# EAGLE design espyollucopy (EAGLE 9.6.2)
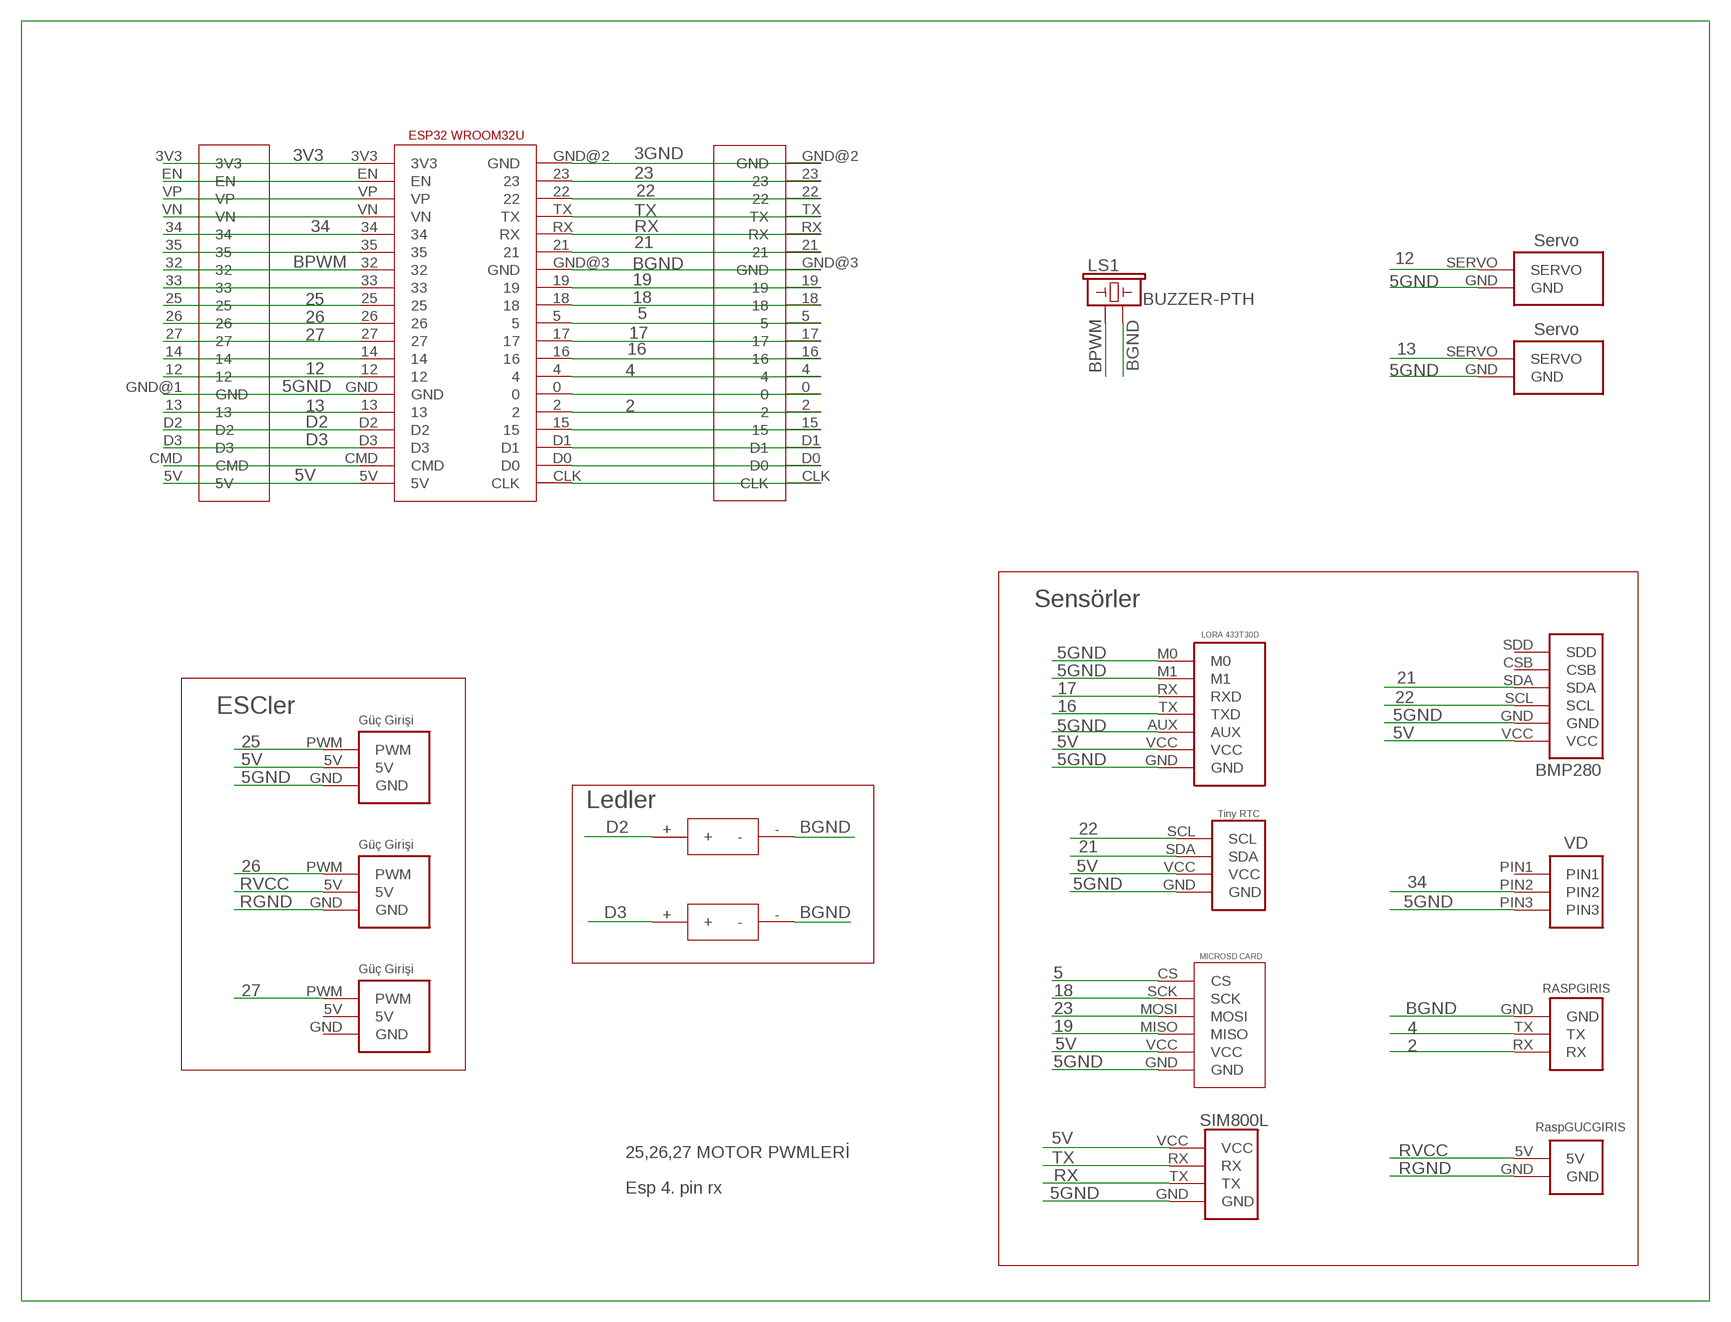
[diagram p0: schematic, sheet 1]

## Parts
BMP1  BMP280  [BMP280]
LS1  BUZZER-PTH  [BUZZER-12MM]
U$1  TINYRTC  [TINYRTC]
U$2  VOLTAGE_DIVIDER  [VOLTAGE_DIVIDER]
U$3  RASPGIRIS  [RASPGIRIS]
U$4  ESP32WROOM32U  [ESP32WROOM32U]
U$5  LORAFULLSIZE  [LORAFULLSIZE]
U$6  MICROSD_CARD  [MICROSD_CARD]
U$7  SERVO_SIGNAL  [SERVO_SIGNAL]
U$8  SIM800L  [SIM800L]
U$9  SERVO_SIGNAL  [SERVO_SIGNAL]
U$10  RASPGUCGIRIS  [RASPGUCGIRIS]
U$11  ESC_GIRIS  [ESC_GIRIS]
U$12  ESC_GIRIS  [ESC_GIRIS]
U$13  ESC_GIRIS  [ESC_GIRIS]
U$14  ESPSAGPIN  [ESPSAGPIN]
U$15  ESPSOLPIN  [ESPSOLPIN]
U$17  LED  [LED]
U$18  LED  [LED]

## Nets
2: U$3.RX U$4.2 U$14.2
3GND: U$4.GND@2(GND) U$14.GND@2(GND)
3V3: U$4.3V3 U$15.3V3
4: U$3.TX U$4.4 U$14.4
5: U$4.5 U$6.CS U$14.5
5GND: BMP1.GND U$1.GND U$2.PIN3 U$4.GND U$5.AUX U$5.GND U$5.M0 U$5.M1 U$6.GND U$7.GND U$8.GND U$9.GND U$11.GND U$15.GND@1(GND)
5V: BMP1.VCC U$1.VCC U$4.5V U$5.VCC U$6.VCC U$8.VCC U$11.5V U$15.5V
12: U$4.12 U$7.SERVO U$15.12
13: U$4.13 U$9.SERVO U$15.13
16: U$4.16 U$5.TX(TXD) U$14.16
17: U$4.17 U$5.RX(RXD) U$14.17
18: U$4.18 U$6.SCK U$14.18
19: U$4.19 U$6.MISO U$14.19
21: BMP1.SDA U$1.SDA U$4.21 U$14.21
22: BMP1.SCL U$1.SCL U$4.22 U$14.22
23: U$4.23 U$6.MOSI U$14.23
25: U$4.25 U$11.PWM U$15.25
26: U$4.26 U$12.PWM U$15.26
27: U$4.27 U$13.PWM U$15.27
34: U$2.PIN2 U$4.34 U$15.34
BGND: LS1.- U$3.GND U$4.GND@3(GND) U$14.GND@3(GND) U$17.- U$18.-
BPWM: LS1.+ U$4.32 U$15.32
D2: U$4.D2 U$15.D2 U$17.+
D3: U$4.D3 U$15.D3 U$18.+
N$3: U$4.EN U$15.EN
N$4: U$4.VP U$15.VP
N$5: U$4.VN U$15.VN
N$7: U$4.35 U$15.35
N$9: U$4.33 U$15.33
N$13: U$4.14 U$15.14
N$19: U$4.CMD U$15.CMD
N$34: U$4.0 U$14.0
N$36: U$4.15 U$14.15
N$37: U$4.D1 U$14.D1
N$38: U$4.D0 U$14.D0
N$39: U$4.CLK U$14.CLK
RGND: U$10.GND U$12.GND
RVCC: U$10.5V U$12.5V
RX: U$4.RX U$8.TX U$14.RX
TX: U$4.TX U$8.RX U$14.TX
Unconnected: BMP1.CSB BMP1.SDD U$2.PIN1 U$13.5V U$13.GND

## Notes on the sheet
- Sensörler
- ESCler
- Ledler
- 25,26,27 MOTOR PWMLERİ
- Esp 4. pin rx

## Library data of the parts
BMP1 = SpatiumB:BMP280
LS1 = SparkFun-Electromechanical:BUZZER: Buzzer Small round buzzers that operate around the audible 2kHz range. You can use these as speakers to create simple music or user interfaces. Variant Overview: PTH - Mini Speaker - PC Mount 12mm 2.048kHz <https://www.sparkfun.com/products/7950> PTH_KIT - Mini Speaker - PC Mount 12mm 2.048kHz <https://www.sparkfun.com/products/7950> KIT simplifies soldering by adding stop mask to one side of the pads. PTH_NO_SILK - Mini Speaker - PC Mount 12mm 2.048kHz <https://www.sparkfun.com/products/7950> No silkscreen indicator of buzzer outline. PTH_KIT_NO_SILK - Mini Speaker - PC Mount 12mm 2.048kHz <https://www.sparkfun.com/products/7950> KIT package w/o silkscreen SMD - Buzzer Audio Magnetic (CCV-084B16) SMD buzzer used on, e.g. the LilyPad Buzzer <https://www.sparkfun.com/products/8463> and RFID USB Reader <https://www.sparkfun.com/products/9963>. SMD_KIT - Buzzer Audio Magnetic (CCV-084B16) SMD Buzzer with elongated pins to make soldering easier. Used on the SparkFun Simon Says - Surface Mount Soldering Kit <https://www.sparkfun.com/products/10935>.; PROD_ID: COMP-08253; SF_SKU: COM-07950
U$1 = SpatMuy2022:TINYRTC
U$2 = SpatiumB:VOLTAGE_DIVIDER
U$3 = SpatMuy2022:RASPGIRIS
U$4 = SpatMuy2022:ESP32WROOM32U
U$5 = SpatMuy2022:LORAFULLSIZE
U$6 = SpatMuy2022:MICROSD_CARD
U$7 U$9 = SpatiumB:SERVO_SIGNAL
U$8 = SpatMuy2022:SIM800L
U$10 = SpatMuy2022:RASPGUCGIRIS
U$11-U$13 = SpatiumB:ESC_GIRIS
U$14 = SpatMuy2022:ESPSAGPIN
U$15 = SpatMuy2022:ESPSOLPIN
U$17 U$18 = SpatMuy2022:LED

## Board
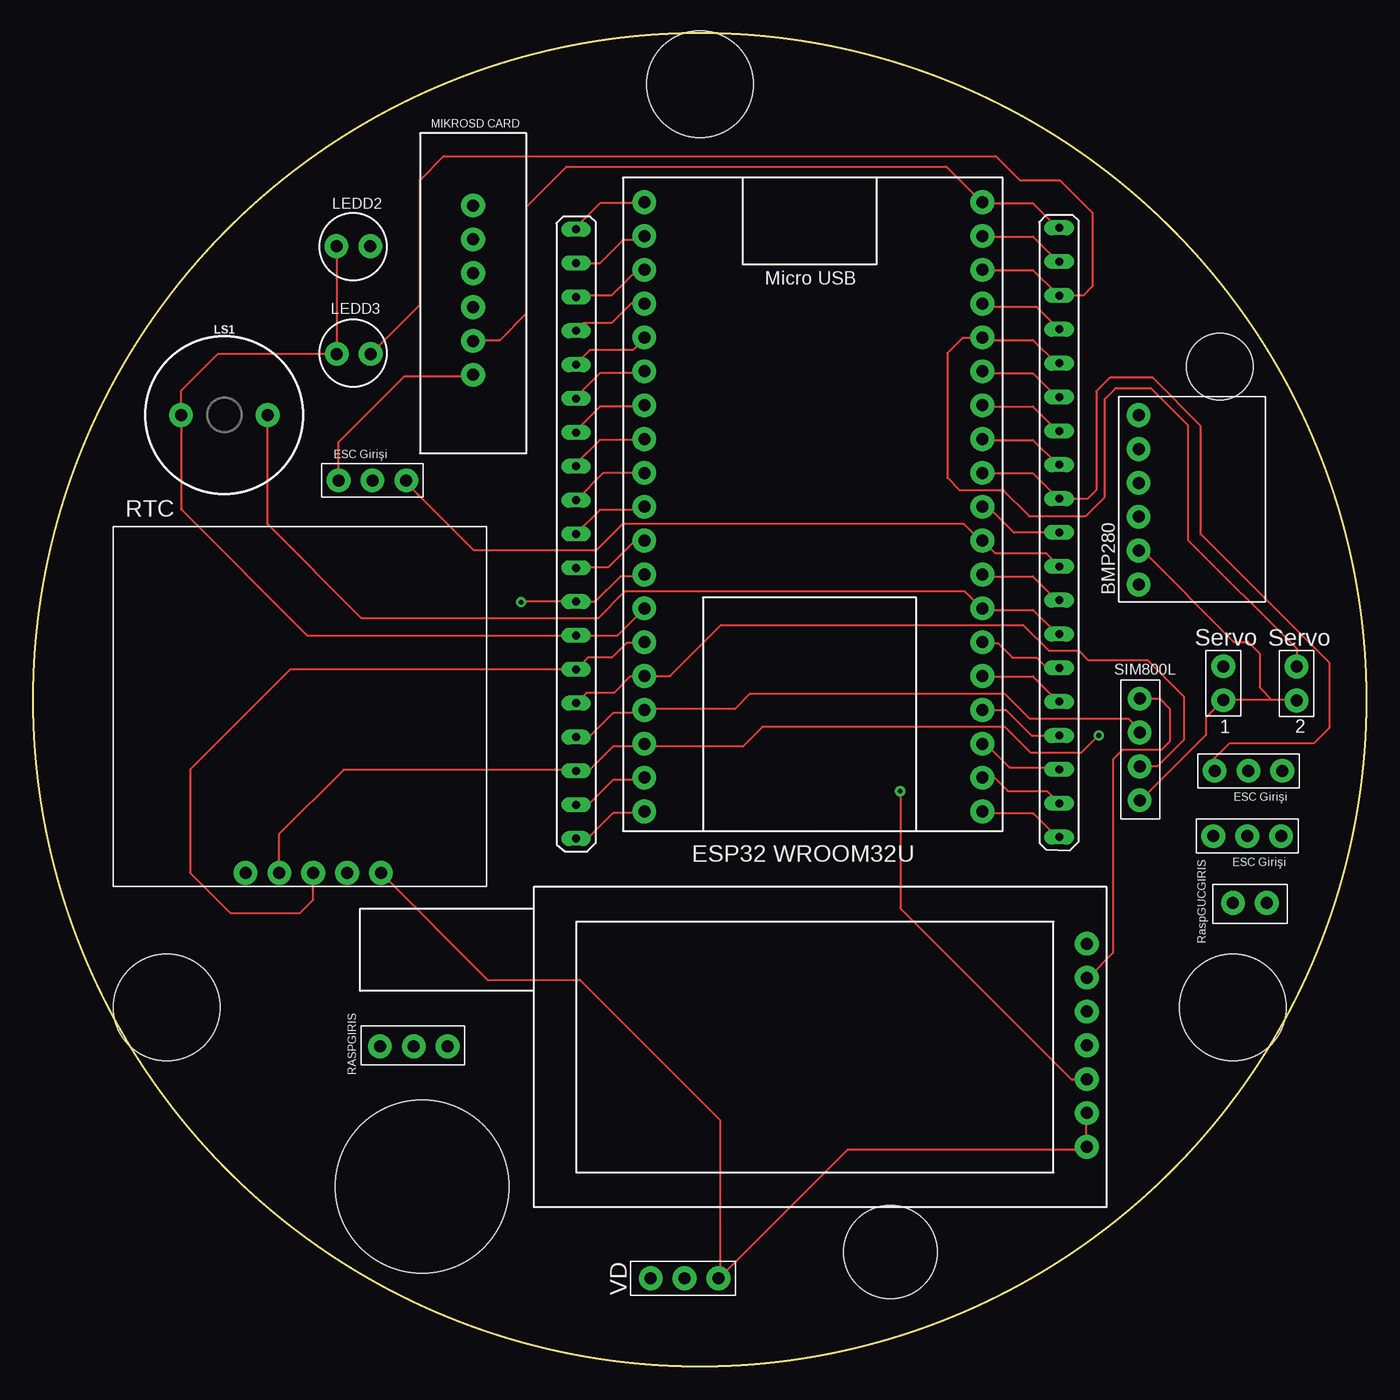
[diagram p1: board, top side]
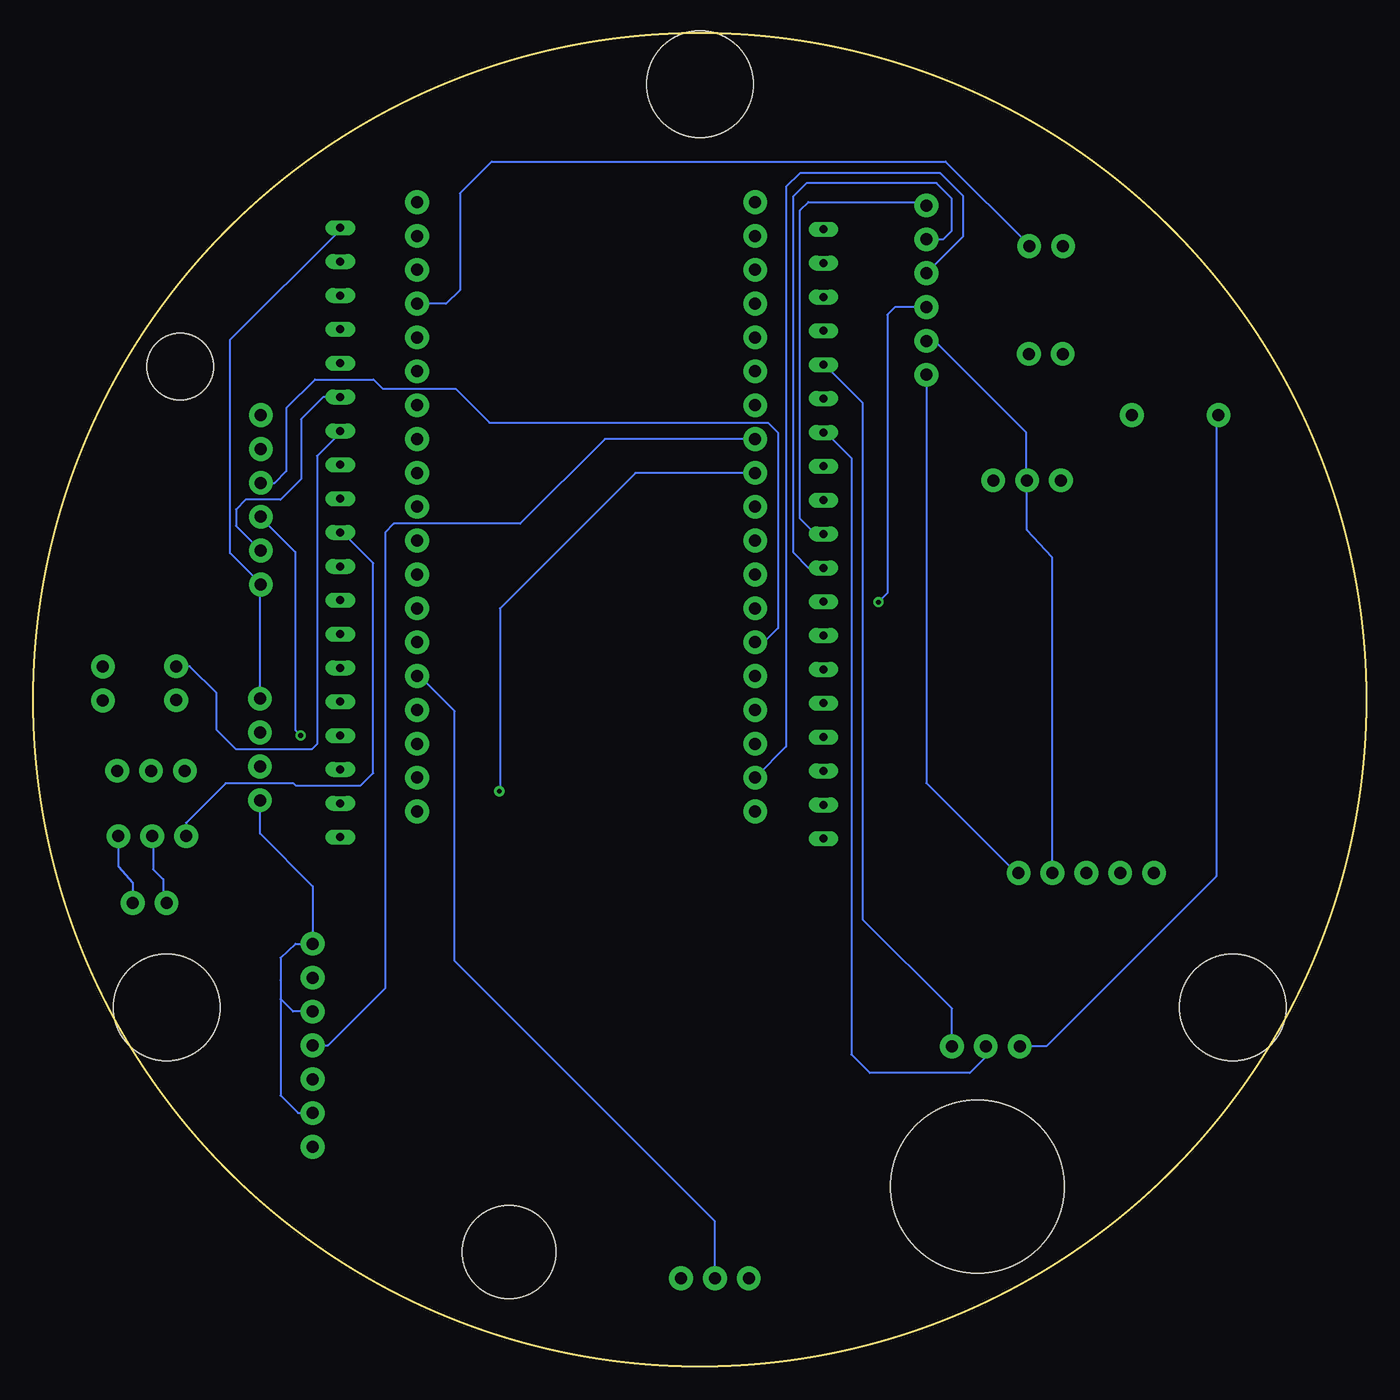
[diagram p2: board, bottom side, seen from below]

Size 100 x 100 mm. Coordinates in mm from the lower left corner, seen from the top.
Outline: circle at 50,50 radius 50
Copper layers (1*16): Top 0.035mm / dielectric 1.5mm / Bottom 0.035mm
Design rules "default": minimum track width 6mil, minimum drill 0.35mm, track to track 6mil, track to pad 6mil, pad to pad 6mil, via to via 6mil, smd to smd 6mil, copper to edge 40mil, drill to drill 6mil, minimum pad ring 10mil, minimum via ring 8mil, stop-mask expansion 4mil, vias tented up to drill 0mil, thermal gap 10mil
Holes 8 mm at 50,96.17 89.98,26.92 10.02,26.92
Holes 13 mm at 29.17,13.48
Holes 5 mm at 89,75
Holes 7 mm at 64.31,8.55

### Footprints (pad centres in the part's own frame; a part is rotated, then mirrored left to right if it is on the bottom)
BMP280 = drill 0.9 pad 1.778: CSB 3.81,3.81; GND -3.81,3.81; SCL -1.27,3.81; SDA 1.27,3.81; SDD 6.35,3.81; VCC -6.35,3.81
BUZZER-12MM = drill 0.9 pad 1.778: + 3.25,0; - -3.25,0
TINYRTC = drill 0.9 pad 1.778: DS -5.08,0; GND 5.08,0; SCL -2.54,0; SDA 0,0; VCC 2.54,0
VOLTAGE_DIVIDER = drill 0.9 pad 1.778: PIN1 0,2.54; PIN2 0,0; PIN3 0,-2.54
RASPGIRIS = drill 0.9 pad 1.778: GND 0,0; RX 0,-5.08; TX 0,-2.54
ESP32WROOM32U = drill 0.9 pad 1.778: 0 27.9,-30.48; 2 27.9,-33.02; 3V3 2.54,2.54; 4 27.9,-27.94; 5 27.9,-20.32; 5V 2.54,-43.18; 12 2.54,-27.94; 13 2.54,-33.02; 14 2.54,-25.4; 15 27.9,-35.56; 16 27.9,-25.4; 17 27.9,-22.86; 18 27.9,-17.78; 19 27.9,-15.24; 21 27.9,-10.16; 22 27.9,-2.54; 23 27.9,0; 25 2.54,-17.78; 26 2.54,-20.32; 27 2.54,-22.86; 32 2.54,-12.7; 33 2.54,-15.24; 34 2.54,-7.62; 35 2.54,-10.16; CLK 27.9,-43.18; CMD 2.54,-40.64; D0 27.9,-40.64; D1 27.9,-38.1; D2 2.54,-35.56; D3 2.54,-38.1; EN 2.54,0; GND 2.54,-30.48; GND@2 27.9,2.54; GND@3 27.9,-12.7; RX 27.9,-7.62; TX 27.9,-5.08; VN 2.54,-5.08; VP 2.54,-2.54
LORAFULLSIZE = drill 0.9 pad 1.778: AUX -10.51,-3.67; GND -10.51,-8.75; M0 -10.51,6.49; M1 -10.51,3.95; RX -10.51,1.41; TX -10.51,-1.13; VCC -10.51,-6.21
MICROSD_CARD = drill 0.9 pad 1.778: CS 0,5.08; GND 0,-7.62; MISO 0,-2.54; MOSI 0,0; SCK 0,2.54; VCC 0,-5.08
SERVO_SIGNAL = drill 0.9 pad 1.778: GND 0,-2.54; SERVO 0,0
SIM800L = drill 0.9 pad 1.778: GND 0,-2.54; RX 0,2.54; TX 0,0; VCC 0,5.08
RASPGUCGIRIS = drill 0.9 pad 1.778: 5V 0,1.27; GND 0,-1.27
ESC_GIRIS = drill 0.9 pad 1.778: 5V 0,0; GND -2.54,0; PWM 2.54,0
ESPSAGPIN = drill 0.6 long: 0 0,0; 2 0,-2.54; 4 0,2.54; 5 0,10.16; 15 0,-5.08; 16 0,5.08; 17 0,7.62; 18 0,12.7; 19 0,15.24; 21 0,20.32; 22 0,27.94; 23 0,30.48; CLK 0,-12.7; D0 0,-10.16; D1 0,-7.62; GND@2 0,33.02; GND@3 0,17.78; RX 0,22.86; TX 0,25.4
ESPSOLPIN = drill 0.6 long: 3V3 0,38.1; 5V 0,-7.62; 12 0,7.62; 13 0,2.54; 14 0,10.16; 25 0,17.78; 26 0,15.24; 27 0,12.7; 32 0,22.86; 33 0,20.32; 34 0,27.94; 35 0,25.4; CMD 0,-5.08; D2 0,0; D3 0,-2.54; EN 0,35.56; GND@1 0,5.08; VN 0,30.48; VP 0,33.02
LED = drill 0.9 pad 1.778: + -2.54,0; - 0,0

### Placement (x,y rotation side)
BMP1  86.74,65 90 top
LS1  14.33,71.36 0 top
U$1  21,37 0 top
U$2  48.86,6.6 90 top
U$3  26,24 90 top
U$4  73.74,44.16 180 top
U$5  68.54,22.94 180 top
U$6  33,82 0 top
U$7  89.28,52.51 0 top
U$8  83,45 0 top
U$9  94.78,52.49 0 top
U$10  91.27,34.76 90 top
U$11  25.44,66.46 0 top
U$12  91.08,39.77 180 top
U$13  91.17,44.67 180 top
U$14  40.72,72.6 180 top
U$15  76.97,77.79 180 top
U$17  22.75,84.03 180 top
U$18  22.77,75.94 180 top

### Tracks (layer width: path | path; a pad name or v marks a point on that pad's centre or on a via)
2
  Top 0.152: U$14.2 40.75,75.25 41.75,76.25 45,76.25 45.75,77 U$4.2
  Bottom 0.152: U$3.RX 31.08,26.83 37.78,33.53 37.78,72.28 40.5,75 U$14.2
3GND
  Top 0.152: U$14.GND@2 41.58,39.58 43.5,41.5 45.75,41.5 U$4.GND@2
3V3
  Top 0.152: U$15.3V3 76.75,39.75 75,41.5 71.25,41.5 U$4.3V3
4
  Top 0.152: U$14.4 40.75,70.25 42.5,72 45.75,72 U$4.4
  Bottom 0.152: U$3.TX 28.54,23.21 29.75,22 37.25,22 38.63,23.38 38.63,68.13 40.5,70 U$14.4
5
  Top 0.152: U$14.5 40.75,62.5 42.5,64.25 45.75,64.25 U$4.5
  Bottom 0.152: U$14.5 41.33,62.44 42.48,63.59 42.48,86.72 41.85,87.34 33.27,87.34 U$6.CS
5GND
  Top 0.152: U$11.GND 22.9,69.35 27.8,74.25 33,74.25 U$6.GND | 51.5,6.75 U$2.PIN3 | U$5.M1 79,18.75 79,16.5 U$5.M0 79,16.25 61.09,16.25 51.5,6.66 51.5,6.75 | U$15.GND@1 76.75,72.75 75,74.5 71.25,74.5 U$4.GND | 94,50 94.75,50 U$9.GND 94,50 | 94,50 92.92,50 | 92.92,50 89.5,50 U$7.GND 88,48.69 88,47.39 83.07,42.46 U$8.GND 83,42.5 | 83,61 BMP1.GND 83.23,61.19 90.08,54.34 91.14,54.34 92,53.48 92,50.92 92.92,50 | 26.25,37 U$1.GND 34.08,29 41,29 51.5,18.5 51.5,6.75
  Bottom 0.152: U$6.GND 33,43.75 26.25,37 U$1.GND | U$8.GND 83,39.96 79.03,36 79.03,31.7 U$5.GND 80.32,31.69 81.45,30.63 81.45,28.95 81.45,27.55 | U$15.GND@1 78.25,72.71 79.91,71.05 79.91,66.54 81.44,65.01 84.07,65.01 84.8,64.28 84.8,63.05 83,61.25 BMP1.GND | 81.45,27.55 81.45,20.3 80.14,18.99 U$5.M1 | U$5.AUX 80.52,26.61 81.45,27.55
5V
  Top 0.152: 71.25,87.25 75,87.25 76.75,85.5 U$15.5V | 71.25,87.25 U$4.5V | U$5.VCC 79.25,29.25 81,31 81,45.54 81.71,46.25 84.65,46.25 85.25,46.86 85.25,49.33 84.5,50.08 U$8.VCC 83,50 | U$6.VCC 33.08,77 35,77 37,79 37,87 40,90 68.5,90 71.25,87.25
  Bottom 0.152: U$1.VCC 23.58,37 23.58,60.71 25.44,62.74 U$11.5V 25.5,66.5 25.5,70.06 32.36,76.92 U$6.VCC | U$8.VCC 83,58.5 BMP1.VCC 83,58.75 85.24,60.99 85.24,77.01 77,85.25 U$15.5V
12
  Top 0.152: U$15.12 76.75,70.25 75,72 71.25,72 U$4.12
  Bottom 0.152: U$7.SERVO 88.25,52.51 86.25,50.5 86.25,47.75 84.78,46.27 79.11,46.27 78.71,46.68 78.71,68.29 77,70 U$15.12
13
  Top 0.152: U$15.13 76.75,75.25 75,77 71.25,77 U$4.13 | 68.57,76.03 68.57,76 | 68.57,76 68.57,66.66 69.47,65.75 72.75,65.75 74.72,63.77 78.96,63.77 80.39,65.2 80.39,72.57 81.21,73.39 83.84,73.39 86.63,70.59 86.63,61.98 94.78,53.84 U$9.SERVO | 71.1,77.09 U$4.13 | 68.57,76 69.75,77.18 U$4.13
16
  Top 0.152: U$14.16 40.75,67.75 42.5,69.5 45.75,69.5 U$4.16
  Bottom 0.152: U$5.TX 77.89,24.07 73.6,28.36 73.6,62.56 72.96,63.21 63.47,63.21 57.12,69.56 U$4.16
17  (via drill 0.35)
  Top 0.152: U$14.17 40.75,65 42.75,67 45.75,67 U$4.17 | v65.04,43.14 65.06,43.12 65.06,34.35 77.88,21.53 77.99,21.53 | 77.99,21.53 U$5.RX | 77.99,21.53
  Bottom 0.152: v65.04,43.14 64.99,43.19 64.99,56.86 54.83,67.02 U$4.17
18
  Top 0.152: U$14.18 40.71,59.91 40.7,59.91 40.72,59.93 43.12,59.93 45.13,61.94 U$4.18
  Bottom 0.152: U$6.SCK 31.73,84.54 31.12,85.16 31.12,87.64 32.24,88.76 | 32.26,88.78 32.24,88.76 | U$14.18 41.83,59.9 42.97,61.04 42.97,87.78 41.99,88.76 32.24,88.76
19  (via drill 0.35)
  Top 0.152: U$4.19 45.75,59.25 44.05,59.25 42.16,57.36 U$14.19 36.63,57.36 v36.59,57.32
  Bottom 0.152: U$6.MISO 35.34,79.46 35.92,78.88 35.92,58 v36.59,57.32
21
  Top 0.152: U$14.21 41.6,53.16 43.41,53.16 44.5,54.25 45.75,54.25 U$4.21 | 40.5,52.25 U$14.21 | U$14.21 19.28,52.28 11.77,44.77 11.77,37.01 14.78,34 20,34 21,35 U$1.SDA
  Bottom 0.152: BMP1.SDA 81.9,66.27 81.02,67.15 81.02,71.88 78.87,74.03 74.48,74.03 73.78,73.33 68.33,73.33 65.78,70.78 44.87,70.78 44.11,70.03 44.11,55.37 45.16,54.32 U$4.21
22  (via drill 0.35)
  Top 0.152: U$1.SCL 18.46,39.95 23.26,44.75 40.5,44.75 U$14.22 41.66,44.66 43.5,46.5 45.75,46.5 U$4.22 46.06,46.48 53.23,46.48 54.7,47.96 72.89,47.96 74.81,46.03 78.63,46.03 79.92,47.32 v79.95,47.32
  Bottom 0.152: v79.95,47.32 80.34,47.72 80.34,61.09 82.75,63.5 BMP1.SCL
23
  Top 0.152: U$14.23 41.62,42.12 43.5,44 45.75,44 U$4.23
  Bottom 0.152: U$6.MOSI 30.26,84.74 30.26,87.82 31.95,89.5 42.49,89.5 43.52,88.48 43.52,46.48 45.75,44.25 U$4.23
25
  Top 0.152: U$11.PWM 28,66.25 33.06,61.19 42.23,61.19 44.21,63.18 69.82,63.18 71,62 U$4.25 72.13,61.01 75.97,61.01 U$15.25
26
  Top 0.152: U$15.26 73.56,62.54 71.62,64.48 U$4.26
  Bottom 0.152: 85.58,43.73 88.54,40.77 U$12.PWM | 85.58,43.73 | U$15.26 76.75,62.5 74.5,60.25 74.5,44.5 75.47,43.54 80.29,43.54 80.48,43.73 85.58,43.73
27
  Top 0.152: U$4.27 71.25,67 75,67 76.75,65.25 U$15.27 76.97,65.07 79.07,65.07 79.75,65.75 79.75,73.15 80.75,74.15 83.98,74.15 87.58,70.55 87.58,62.43 97.27,52.75 97.27,47.93 96.09,46.75 89.75,46.75 88.63,45.63 U$13.PWM
34
  Top 0.152: U$15.34 76.75,50 75,51.75 71.25,51.75 U$4.34
  Bottom 0.152: U$4.34 71,51.75 68.39,49.14 68.39,30.39 48.86,10.86 U$2.PIN2
BGND
  Top 0.152: U$17.- 22.75,84 22.75,76 U$18.- 22.77,75.92 13.82,75.92 11.08,73.18 LS1.- 11.08,64.29 20.53,54.84 40.7,54.84 U$14.GND@3 43.82,54.82 45.75,56.75 U$4.GND@3
  Bottom 0.152: U$3.GND 24,24 11.25,36.75 11.25,71.25 LS1.-
BPWM
  Top 0.152: U$15.32 76.75,55 75,56.75 71.25,56.75 U$4.32 71,57 69.89,58.11 44.36,58.11 42.36,56.11 24.64,56.11 17.58,63.17 LS1.+
D2
  Top 0.152: U$15.D2 76.75,78 75.25,79.5 71.25,79.5 U$4.D2
  Bottom 0.152: U$17.+ 25.29,84.11 31.56,90.39 65.61,90.39 68,88 68,80.75 69.03,79.72 U$4.D2
D3
  Top 0.152: U$4.D3 71.25,82.25 75,82.25 76.75,80.5 U$15.D3 78.78,80.33 79.47,81.03 79.47,86.53 77,89 74,89 72.21,90.79 30.79,90.79 29,89 29,79.64 U$18.+
N$3
  Top 0.152: U$4.EN 72.09,44.16 73.11,43.15 76.05,43.15 U$15.EN
N$4
  Top 0.152: U$4.VP 71.48,46.7 73.25,44.93 76.82,44.93 U$15.VP
N$5
  Top 0.152: U$15.VN 76.93,47.27 74.92,47.27 72.95,49.24 U$4.VN
N$7
  Top 0.152: U$4.35 71.25,54.25 72.36,54.25 73.45,53.15 75.27,53.15 76.03,52.39 U$15.35
N$9
  Top 0.152: U$15.33 76.75,57.5 75,59.25 71.25,59.25 U$4.33
N$13
  Top 0.152: U$15.14 76.75,67.75 75,69.5 71.25,69.5 U$4.14
N$19
  Top 0.152: U$15.CMD 76.75,83 75,84.75 71.25,84.75 U$4.CMD
N$34
  Top 0.152: U$14.0 40.75,72.75 42.5,74.5 45.75,74.5 U$4.0
N$36
  Top 0.152: U$4.15 44.83,79.72 43.37,78.26 41.31,78.26 U$14.15
N$37
  Top 0.152: U$14.D1 40.83,80.32 43.37,80.32 45.29,82.25 45.75,82.25 U$4.D1
N$38
  Top 0.152: U$14.D0 42.51,82.76 44.23,84.49 45.26,84.49 U$4.D0
N$39
  Top 0.152: U$14.CLK 40.75,85.5 42.5,87.25 45.75,87.25 U$4.CLK
RGND
  Bottom 0.152: U$12.GND 93.62,37.51 92.54,36.26 U$10.GND
RVCC
  Bottom 0.152: U$10.5V 90.25,35 90.25,36.52 91.01,37.29 91.01,39.75 U$12.5V
RX
  Top 0.152: U$14.RX 41.5,50.52 43.56,50.52 44.82,51.78 U$4.RX 47.78,51.78 51.61,55.61 74.26,55.61 76.19,53.68 78.43,53.68 79.11,53 83.57,53 86.33,50.23 86.33,46.99 84.34,45 U$8.TX
TX
  Top 0.152: U$14.TX 41.7,47.2 43.5,49 45.75,49 U$4.TX 45.9,49.3 52.63,49.3 53.78,50.45 72.87,50.45 74.73,48.59 82.16,48.59 83,47.75 U$8.RX

### Text on the board
tPlace: 2 | 1
tNames: LEDD2 | LEDD3